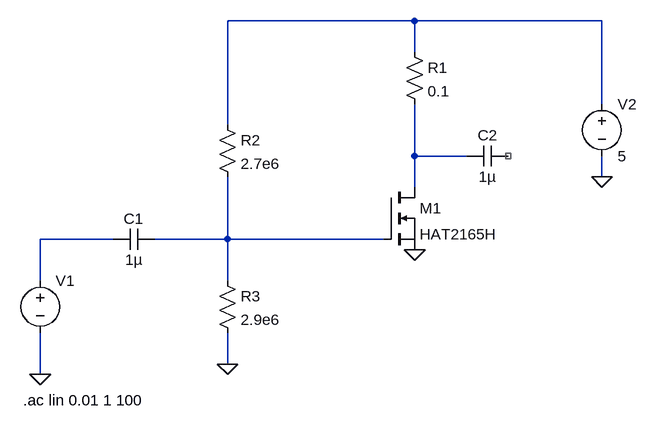
[diagram p0: schematic Draft3.asc]
Draft3.asc, the LTspice schematic file:
Version 4
SHEET 1 1080 680
WIRE 720 -320 432 -320
WIRE 1008 -320 720 -320
WIRE 720 -272 720 -320
WIRE 1008 -192 1008 -320
WIRE 432 -160 432 -320
WIRE 720 -112 720 -192
WIRE 800 -112 720 -112
WIRE 1008 -80 1008 -112
WIRE 720 -64 720 -112
WIRE 256 16 144 16
WIRE 432 16 432 -80
WIRE 432 16 320 16
WIRE 672 16 432 16
WIRE 144 80 144 16
WIRE 432 80 432 16
WIRE 432 208 432 160
WIRE 144 224 144 160
FLAG 144 224 0
FLAG 432 208 0
FLAG 1008 -80 0
FLAG 720 32 0
SYMBOL voltage 144 64 R0
WINDOW 123 0 0 Left 0
WINDOW 39 0 0 Left 0
SYMATTR InstName V1
SYMATTR Value ""
SYMBOL cap 320 0 R90
WINDOW 0 0 32 VBottom 2
WINDOW 3 32 32 VTop 2
SYMATTR InstName C1
SYMATTR Value 1µ
SYMBOL res 416 -176 R0
SYMATTR InstName R2
SYMATTR Value 2.7e6
SYMBOL res 416 64 R0
SYMATTR InstName R3
SYMATTR Value 2.9e6
SYMBOL res 704 -288 R0
SYMATTR InstName R1
SYMATTR Value 0.1
SYMBOL voltage 1008 -208 R0
WINDOW 123 0 0 Left 0
WINDOW 39 0 0 Left 0
SYMATTR InstName V2
SYMATTR Value 5
SYMBOL cap 800 -128 M90
WINDOW 0 0 32 VBottom 2
WINDOW 3 32 32 VTop 2
SYMATTR InstName C2
SYMATTR Value 1µ
SYMBOL nmos 672 -64 R0
SYMATTR InstName M1
SYMATTR Value HAT2165H
TEXT 118 264 Left 2 !.ac lin 0.01 1 100

The netlist it stands for:
* Draft3.asc
V1 N003 0
C1 N004 N003 1µ
R2 N001 N004 2.7e6
R3 N004 0 2.9e6
R1 N001 N002 0.1
V2 N001 0 5
C2 N002 NC_01 1µ
M1 N002 N004 0 0 HAT2165H
.model NMOS NMOS
.model PMOS PMOS
.lib standard.mos
.ac lin 0.01 1 100
.backanno
.end